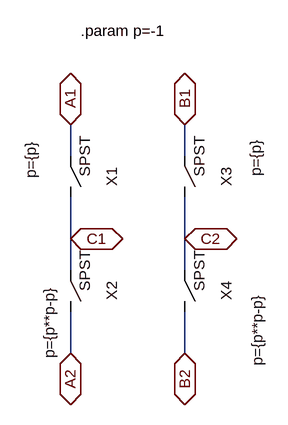
[diagram p0: schematic DPDT_OnOn.asc]
DPDT_OnOn.asc, the LTspice schematic file:
Version 4
SHEET 1 1536 680
WIRE 832 192 832 144
WIRE 1008 192 1008 144
WIRE 832 320 832 256
WIRE 1008 320 1008 256
WIRE 832 368 832 320
WIRE 1008 368 1008 320
WIRE 832 496 832 432
WIRE 1008 496 1008 432
FLAG 832 144 A1
IOPIN 832 144 BiDir
FLAG 1008 144 B1
IOPIN 1008 144 BiDir
FLAG 832 320 C1
IOPIN 832 320 BiDir
FLAG 1008 320 C2
IOPIN 1008 320 BiDir
FLAG 832 496 A2
IOPIN 832 496 BiDir
FLAG 1008 496 B2
IOPIN 1008 496 BiDir
SYMBOL SPST 832 224 R90
WINDOW 39 -26 61 Center 2
SYMATTR SpiceLine p={p}
SYMATTR InstName X1
SYMBOL SPST 832 400 R90
WINDOW 39 48 33 Center 2
SYMATTR SpiceLine p={p**p-p}
SYMATTR InstName X2
SYMBOL SPST 1008 224 R90
WINDOW 39 -29 -109 Center 2
SYMATTR SpiceLine p={p}
SYMATTR InstName X3
SYMBOL SPST 1008 400 R90
WINDOW 39 60 -111 Center 2
SYMATTR SpiceLine p={p**p-p}
SYMATTR InstName X4
TEXT 848 0 Left 2 !.param p=-1

The netlist it stands for:
* DPDT_OnOn.asc
XX1 A1 C1 SPST p={p}  ; pins In Out
XX2 C1 A2 SPST p={p**p-p}  ; pins In Out
XX3 B1 C2 SPST p={p}  ; pins In Out
XX4 C2 B2 SPST p={p**p-p}  ; pins In Out
.param p=-1
.backanno
.end